# EAGLE design Adafruit Chainable DS18B20 Extender Breakout (EAGLE 9.6.2)
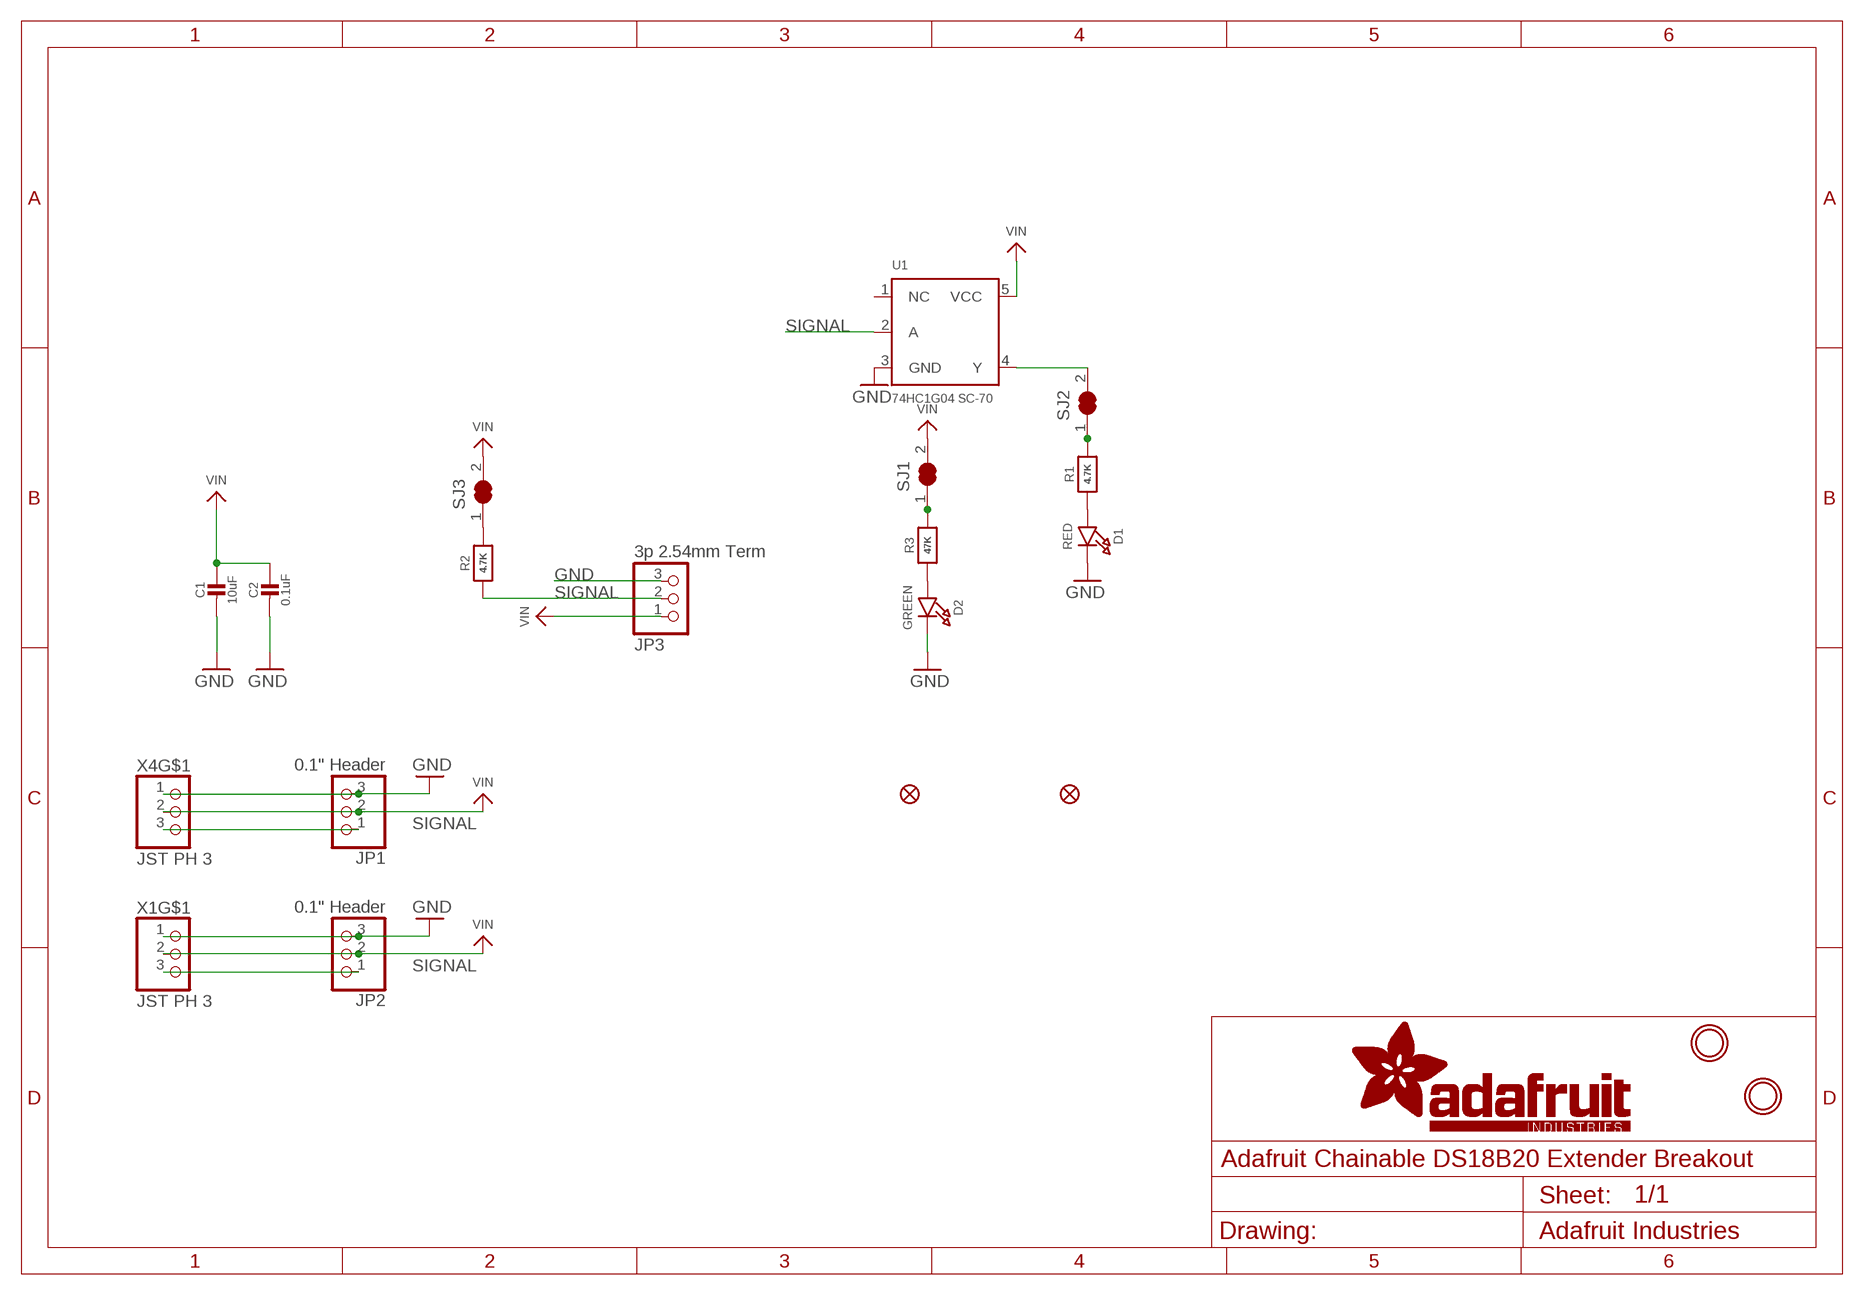
[diagram p0: schematic, sheet 1]

## Parts
C1  10uF  CAP_CERAMIC0805-NOOUTLINE  [0805-NO]
C2  0.1uF  CAP_CERAMIC0603_NO  [0603-NO]
D1  RED  LED0603_NOOUTLINE  [CHIPLED_0603_NOOUTLINE]
D2  GREEN  LED0603_NOOUTLINE  [CHIPLED_0603_NOOUTLINE]
FID2  FIDUCIAL_1MM  [FIDUCIAL_1MM]
FID3  FIDUCIAL_1MM  [FIDUCIAL_1MM]
JP1  0.1" Header  HEADER-1X3  [1X03_OVAL]
JP2  0.1" Header  HEADER-1X3  [1X03_OVAL]
JP3  3p 2.54mm Term  HEADER-1X3_254TERM  [1X03_2.54MMTERMINAL]
R1  4.7K  RESISTOR_0603_NOOUT  [0603-NO]
R2  4.7K  RESISTOR_0603_NOOUT  [0603-NO]
R3  47K  RESISTOR_0603_NOOUT  [0603-NO]
SJ1  SOLDERJUMPER_CLOSED  [SOLDERJUMPER_CLOSEDWIRE]
SJ2  SOLDERJUMPER_CLOSED  [SOLDERJUMPER_CLOSEDWIRE]
SJ3  SOLDERJUMPER_CLOSED  [SOLDERJUMPER_CLOSEDWIRE]
U1  74HC1G04 SC-70  74LVC1G04SC-70  [SC70-5]
U$1  MOUNTINGHOLE2.0  [MOUNTINGHOLE_2.0_PLATED]
U$8  MOUNTINGHOLE2.0  [MOUNTINGHOLE_2.0_PLATED]
X1  JST PH 3  CON_JST_PH_3PIN  [JSTPH3]
X4  JST PH 3  CON_JST_PH_3PIN  [JSTPH3]

## Nets
GND: C1.2 C2.2 D1.C D2.C JP1.3 JP2.3 JP3.3 U1.3(GND) X1.1 X4.1
N$1: R3.2 SJ1.1
N$2: D1.A R1.1
N$3: R1.2 SJ2.1
N$4: R2.2 SJ3.1
N$5: SJ2.2 U1.4(Y)
N$26: D2.A R3.1
SIGNAL: JP1.1 JP2.1 JP3.2 R2.1 U1.2(A) X1.3 X4.3
VIN: C1.1 C2.1 JP1.2 JP2.2 JP3.1 SJ1.2 SJ3.2 U1.5(VCC) X1.2 X4.2
Unconnected: U1.1(NC) X1.NC1(MT) X1.NC2(MT) X4.NC1(MT) X4.NC2(MT)

## Library data of the parts
C1 C2 = microbuilder:CAP_CERAMIC: Ceramic Capacitors For new designs, use the packages preceded by an '_' character since they are more reliable: The following footprints should be used on most boards: _0402 - Standard footprint for regular board layouts _0603 - Standard footprint for regular board layouts _0805 - Standard footprint for regular board layouts _1206 - Standard footprint for regular board layouts For extremely tight-pitch boards where space is at a premium, the following 'micro-pitch' footprints can be used (smaller pads, no silkscreen outline, etc.): _0402MP - Micro-pitch footprint for very dense/compact boards _0603MP - Micro-pitch footprint for very dense/compact boards _0805MP - Micro-pitch footprint for very dense/compact boards _1206MP - Micro-pitch footprint for very dense/compact boards
D1 D2 = microbuilder:LED: LED 0603 - 0603 Surface Mount Package 2mA: Green LED - Low Power (3.9mcd, 2ma, 1.7Vf) - Digikey: 475-2709-2-ND Orange LED - Low Power (9.8mcd, 2ma, 1.8Vf) - Digikey: 475-1194-2-ND Red LED - Low Power (5mcd, 2ma, 1.8Vf) - Digikey: 475-1195-2-ND Yellow LED - Low Power (7mcd, 2ma, 1.8Vf) - Digikey: 475-1196-2-ND 5mA: Blue LED - Low Power (17mcd, 5ma, 2.9Vf) - Digikey: LNJ937W8CRACT-ND 0805 - 0805 Surface Mount Package 2mA: Red LED (8.8mcd, 2mA, 1.8Vf, Clear) - Low Power [Digikey: 475-2510-1-ND] Green LED (5mcd, 2mA, 1.8Vf, Clear) - Low Power [Digikey: 475-2730-1-ND] Yellow LED (11.3mcd, 2mA, 1.8Vf, Clear) - Low Power [Digikey: 475-2555-1-ND] 20mA: Red LED (104mcd, 20mA, Diffused) - LS R976 [Digikey: 475-1278-6-ND] Red LED (12mcd, 20mA, 2.0Vf, Clear) - APT2012EC [Digikey: 754-1128-1-ND] Green LED (15mcd, 20mA, 2.2Vf, Clear) - APT2012GC [Digikey: 754-1131-1-ND] Orange LED (160mcd, 20mA, 2.1Vf, Clear) - APT2012SECK [Digikey: 754-1130-1-ND] 1206 - 1206 Surface Mount Package Green LED (26mcd, 20mA, Diffused) - LG N971 [Digikey: 475-1407-6-ND] Red LED (15mcd, 20mA, Diffused) - LH N974 [Digikey: 475-1416-6-ND] Cree - Cree High-Power Surface Mount LEDs XPEBWT-L1-0000-00D50 - White 111lm 350mA 2.9Vf 6200K 110° XTEAWT-00-0000-00000LEE3 - White 114lm 350mA 2.85Vf 5000K 115° Everlight - Everlight 45-21 Series Surface Mount LEDs 45-21/QK2C-B2832AC2CB2/2T - Warm White 2000mcd 20mA 3.25Vf 3050K 120° 45-21/LK2C-B38452C4CB2/2T - Nuetral White 2000mcd 20mA 3.25Vf 4150K 120° 45-21/LK2C-B50634C6CB2/2T - Cold White 2200mcd 20mA 3.25Vf 5650K 120° PLCC2 Reverse Mount LS T77K-J1L2-1-0-2-R18-Z - Red 11.25mcd 2mA 1.8Vf 630nm 120° LO T77K-L1M2-24-Z - Orange 19.6mcd 2mA 1.8Vf 606nm 120° LY T77K-K2M1-26-Z - Yellow 15.7mcd 2mA 1.8Vf 587nm 120°; ROT: 270
FID2 FID3 = microbuilder:FIDUCIAL: Fiducial Alignment Points Various fiducial points for machine vision alignment.; BOM: EXCLUDE
JP1-JP3 = microbuilder:HEADER-1X3: PIN HEADER
R1-R3 = microbuilder:RESISTOR: Resistors For new designs, use the packages preceded by an '_' character since they are more reliable: The following footprints should be used on most boards: _0402 - Standard footprint for regular board layouts _0603 - Standard footprint for regular board layouts _0805 - Standard footprint for regular board layouts _1206 - Standard footprint for regular board layouts For extremely tight-pitch boards where space is at a premium, the following 'micro-pitch' footprints can be used (smaller pads, no silkscreen outline, etc.): _0402MP - Micro-pitch footprint for very dense/compact boards _0603MP - Micro-pitch footprint for very dense/compact boards _0805MP - Micro-pitch footprint for very dense/compact boards _1206MP - Micro-pitch footprint for very dense/compact boards
SJ1-SJ3 = microbuilder:SOLDERJUMPER_CLOSED: Solder Jumper - Closed These solder jumpers are closed by default CLOSEDWIRE - 10 mil trace between pads that can be cut and resoldered later CLOSEDPERM - 63 mil trace between pads for a permanent connection (used to 'bridge' two signals, a shameless hack for Eagle). Can double as a test point as well (no cream layer)
U1 = microbuilder:74LVC1G04: 74LVC1G04 - Single Inverter Gate SOT23-5 SN74LVC1G04DBVR - Digikey: 296-11599-1-ND
U$1 U$8 = adafruit_electromech:MOUNTINGHOLE: Mounting Hole For #2 screws (0.086"/2.18mm width, 0.094"/2.4mm hole) use 2.5mm; BOM: EXCLUDE
X1 X4 = adafruit_electromech:CON_JST_PH_3PIN

## Net classes
1 HV: width 0.406 mm, drill 0.381 mm, clearance 0.762 mm

## Board
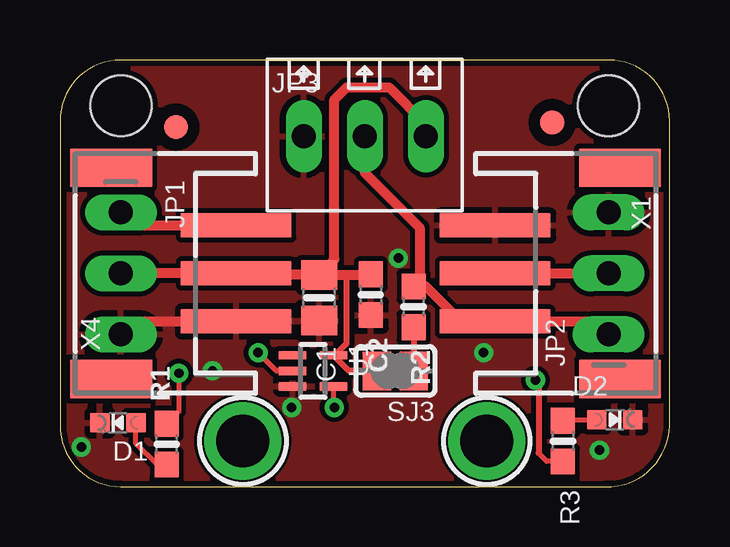
[diagram p1: board, top side]
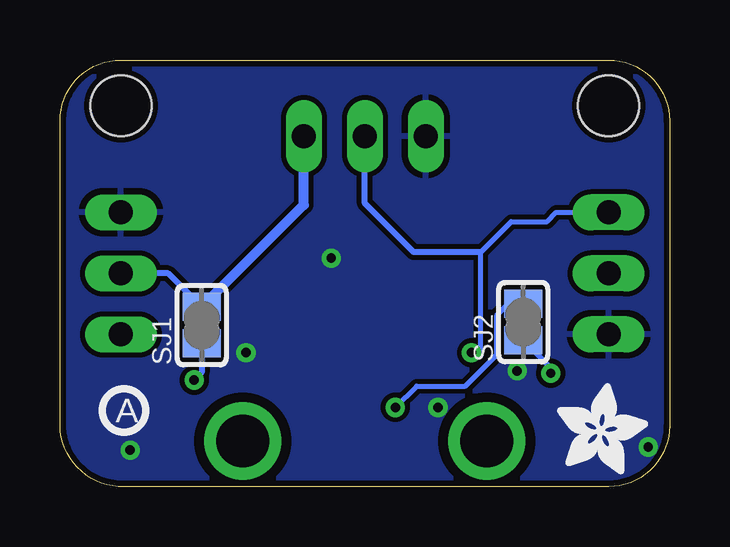
[diagram p2: board, bottom side, seen from below]

Size 25.4 x 17.78 mm. Coordinates in mm from the lower left corner, seen from the top.
Outline: 25.4,2.54 25.4,15.24 arc90 22.86,17.78 2.54,17.78 arc90 0,15.24 0,2.54 arc90 2.54,0 22.73,0 arc90 25.4,2.54
Copper layers (1*16): Top 0.035mm / dielectric 1.5mm / Bottom 0.035mm
Design rules "adafruit": minimum track width 8mil, minimum drill 15.5mil, track to track 8mil, track to pad 8mil, pad to pad 8mil, via to via 8mil, smd to smd 8mil, copper to edge 10mil, drill to drill 8mil, minimum pad ring 10mil, minimum via ring 8mil, stop-mask expansion 2mil, vias tented up to drill 20mil, thermal gap 10mil
Holes 2.54 mm at 2.54,15.88 22.86,15.88

### Footprints (pad centres in the part's own frame; a part is rotated, then mirrored left to right if it is on the bottom)
0805-NO = smd 1.24 x 1.5: 1 -0.95,0; 2 0.95,0
0603-NO = smd 1.075 x 1: 1 -0.85,0; 2 0.85,0
CHIPLED_0603_NOOUTLINE = smd 0.8 x 0.8: A 0,-0.75; C 0,0.75
FIDUCIAL_1MM = smd 1 x 1: 1 0,0
1X03_OVAL = drill 1 long: 1 -2.54,0; 2 0,0; 3 2.54,0
1X03_2.54MMTERMINAL = drill 1 long: 1 2.54,0; 2 0,0; 3 -2.54,0
SOLDERJUMPER_CLOSEDWIRE = smd 1.168 x 1.6: 1 -0.762,0; 2 0.762,0 | smd 0.635 x 0.203: WIRE 0,0
SC70-5 = smd 0.35 x 1.15: 1 -0.65,-0.85; 2 0,-0.85; 3 0.65,-0.85; 4 0.65,0.85; 5 -0.65,0.85
MOUNTINGHOLE_2.0_PLATED = drill 2.2 pad 3: P$1 0,0
JSTPH3 = smd 1 x 4.6: 1 -2,-2.7; 2 0,-2.7; 3 2,-2.7 | smd 1.6 x 3.4: NC1 -4.4,2.5; NC2 4.4,2.5

### Placement (x,y rotation side)
C1  10.79,7.87 270 top
C2  12.95,8 270 top
D1  2.41,2.67 90 top
D2  23.11,2.79 270 top
FID2  4.83,14.99 0 top
FID3  20.51,15.18 0 top
JP1  2.54,8.89 270 top
JP2  22.86,8.89 90 top
JP3  12.7,14.61 0 top
PLABEL0  [PLABEL0]  21.84,1.02 0 top
PLABEL1  [PLABEL1]  1.4,0.89 0 top
PLABEL13  [PLABEL13]  6.1,9.4 0 bottom
PLABEL14  [PLABEL14]  19.56,9.27 0 bottom
PLABEL15  [PLABEL15]  4.06,16.13 0 top
PLABEL16  [PLABEL16]  9.91,9.91 0 top
PLABEL17  [PLABEL17]  17.27,16.26 0 top
PLABEL18  [PLABEL18]  12.7,1.65 0 top
PLABEL19  [PLABEL19]  16.51,4.95 90 top
PLABEL20  [PLABEL20]  8.64,17.14 0 bottom
PLABEL21  [PLABEL21]  12.83,17.14 0 bottom
PLABEL22  [PLABEL22]  16.38,17.02 0 bottom
PLABEL24  [PLABEL24]  12.83,8.26 0 bottom
PLABEL25  [PLABEL25]  12.83,2.03 0 bottom
R1  4.45,1.78 90 top
R2  14.73,7.49 270 top
R3  20.95,1.91 270 top
SJ1  19.49,6.73 90 bottom
SJ2  6.1,6.86 90 bottom
SJ3  13.97,4.83 180 top
U1  10.54,4.83 270 top
U$1  17.78,1.91 0 top
U$3  [PCBFEAT-REV-040]  22.73,3.17 0 bottom
U$8  7.62,1.91 0 top
U$12  [ADAFRUIT_3.5MM]  4.7,0.51 0 bottom
X1  20.83,8.89 270 top
X4  4.64,8.89 90 top

### Tracks (layer width: path | path; a pad name or v marks a point on that pad's centre or on a via)
GND  (via drill 0.39)
  Top 0.406: JP1.3 3.08,6.89 X4.1
  other vias: 22.48,1.52 9.65,3.3 6.35,4.83 14.1,9.53 17.65,5.59 0.89,1.65
  pour Top: 0,0 0,15.24 arc-90 2.54,17.78 25.4,17.78 25.4,0
  pour Bottom: 0,17.78 25.4,17.78 25.4,0 0,0
N$1  (via drill 0.39)
  Top 0.203: R3.2 20.28,1.05 19.94,1.4
  Top 0.254: v19.81,4.45 19.94,4.32 19.94,1.4
  Bottom 0.254: SJ1.1 19.49,4.76 v19.81,4.45
N$2
  Top 0.203: R1.1 4.03,0.93 3.16,1.79 D1.A
N$3  (via drill 0.39)
  Top 0.203: v4.95,4.73 4.95,3.14 R1.2
  Bottom 0.203: SJ2.1 4.95,4.95 v4.95,4.73
N$4
  Top 0.254: R2.2 SJ3.1
N$5  (via drill 0.39)
  Top 0.203: U1.4 11.39,3.34 v11.43,3.3
  Bottom 0.203: v11.43,3.3 10.54,4.19 8.51,4.19 7.2,5.5 7.2,7.15 6.73,7.62 SJ2.2
N$26
  Top 0.203: R3.1 20.99,2.79 D2.A
SIGNAL  (via drill 0.39)
  Top 0.203: U1.2 9.02,4.83 v8.26,5.59
  Top 0.406: JP1.1 3.08,10.89 X4.3 | JP2.1 22.32,6.89 X1.3 16.69,6.89 15.24,8.34 R2.1 14.99,8.6 14.99,10.79 12.7,13.08 JP3.2
  Bottom 0.203: v8.26,5.59 8,5.59 7.87,5.71 7.87,9.78 6.6,11.05 5.11,11.05 4.72,11.43 JP1.1
  Bottom 0.254: 7.87,9.78 10.67,9.78 12.7,11.81 JP3.2
VIN
  Top 0.254: SJ3.2 12.04,4.83 U1.5 11.45,5.48 11.94,5.97 11.94,8.82
  Top 0.406: JP1.2 X4.2 8.76,8.89 8.83,8.82 C1.1 | X1.2 JP2.2 | C1.1 11.94,8.82 12.93,8.82 C2.1 | C1.1 11.43,9.46 11.43,16.13 11.94,16.64 13.72,16.64 15.24,15.11 JP3.1
  Bottom 0.254: SJ1.2 20.89,8.89 JP2.2
  Bottom 0.406: SJ1.2 15.24,11.75 JP3.1

### Text on the board
Pinguin_tBackup: GND | V+ | Signal | PU | DS18B20 / STEMMA
Pinguin_bBackup: DS18B20 Sensor | GND | V+ | Signal | DS18B20 / Extender / Chaining / Breakout | Vin/Vlogic / 3~5VDC